# EAGLE design ForceBoard (EAGLE 9.4.2)
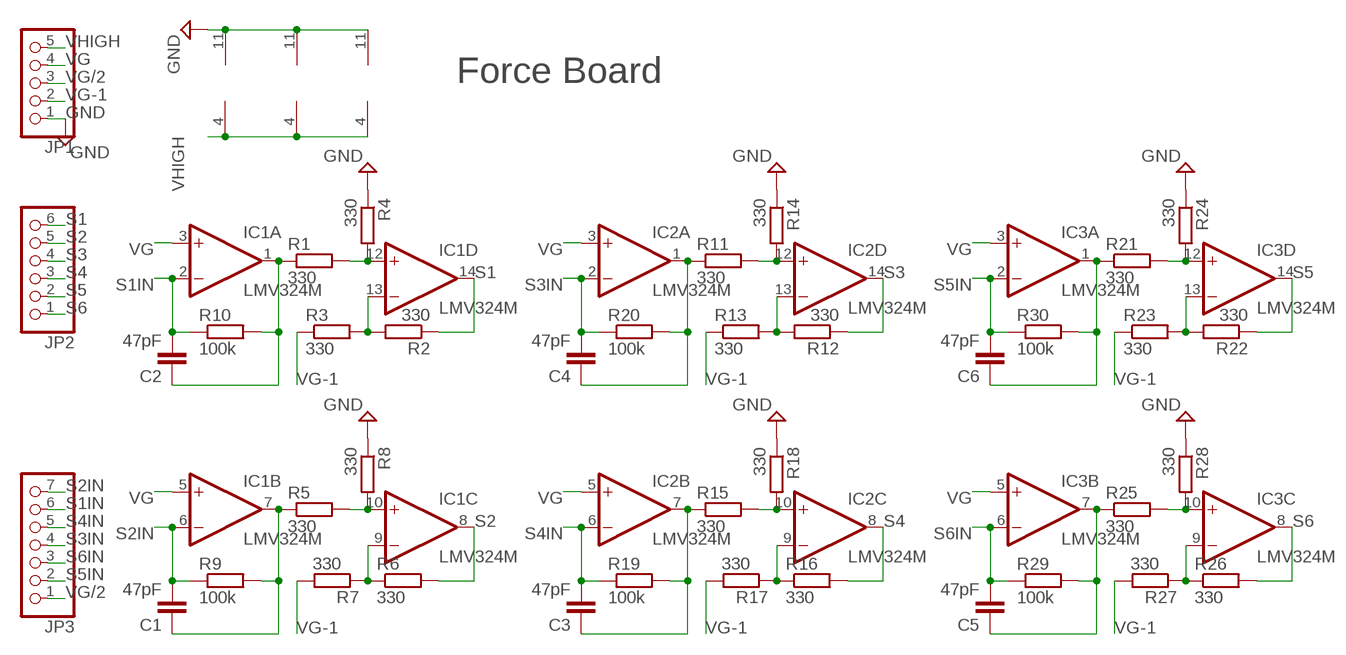
[diagram p0: schematic, sheet 1]

## Parts
C1  47pF  C-EUC0805  [C0805]
C2  47pF  C-EUC0805  [C0805]
C3  47pF  C-EUC0805  [C0805]
C4  47pF  C-EUC0805  [C0805]
C5  47pF  C-EUC0805  [C0805]
C6  47pF  C-EUC0805  [C0805]
IC1  LMV324M  [SO14]
IC2  LMV324M  [SO14]
IC3  LMV324M  [SO14]
JP1  PINHD-1X5  [1X05]
JP2  PINHD-1X6  [1X06]
JP3  PINHD-1X7  [1X07]
R1  330  R-EU_R0805  [R0805]
R2  330  R-EU_R0805  [R0805]
R3  330  R-EU_R0805  [R0805]
R4  330  R-EU_R0805  [R0805]
R5  330  R-EU_R0805  [R0805]
R6  330  R-EU_R0805  [R0805]
R7  330  R-EU_R0805  [R0805]
R8  330  R-EU_R0805  [R0805]
R9  100k  R-EU_R0805  [R0805]
R10  100k  R-EU_R0805  [R0805]
R11  330  R-EU_R0805  [R0805]
R12  330  R-EU_R0805  [R0805]
R13  330  R-EU_R0805  [R0805]
R14  330  R-EU_R0805  [R0805]
R15  330  R-EU_R0805  [R0805]
R16  330  R-EU_R0805  [R0805]
R17  330  R-EU_R0805  [R0805]
R18  330  R-EU_R0805  [R0805]
R19  100k  R-EU_R0805  [R0805]
R20  100k  R-EU_R0805  [R0805]
R21  330  R-EU_R0805  [R0805]
R22  330  R-EU_R0805  [R0805]
R23  330  R-EU_R0805  [R0805]
R24  330  R-EU_R0805  [R0805]
R25  330  R-EU_R0805  [R0805]
R26  330  R-EU_R0805  [R0805]
R27  330  R-EU_R0805  [R0805]
R28  330  R-EU_R0805  [R0805]
R29  100k  R-EU_R0805  [R0805]
R30  100k  R-EU_R0805  [R0805]

## Nets
GND: IC1.11(P:V-) IC2.11(P:V-) IC3.11(P:V-) JP1.1 R4.1 R8.1 R14.1 R18.1 R24.1 R28.1
N$1: IC2.13(D:-IN) R12.2 R13.2
N$2: IC1.10(C:+IN) R5.2 R8.2
N$3: IC1.13(D:-IN) R2.2 R3.2
N$4: C1.1 IC1.7(B:OUT) R5.1 R9.2
N$5: IC1.9(C:-IN) R6.1 R7.1
N$6: IC1.12(D:+IN) R1.2 R4.2
N$7: C3.1 IC2.7(B:OUT) R15.1 R19.2
N$8: IC2.9(C:-IN) R16.1 R17.1
N$9: C2.1 IC1.1(A:OUT) R1.1 R10.2
N$10: IC2.10(C:+IN) R15.2 R18.2
N$11: IC2.12(D:+IN) R11.2 R14.2
N$12: C4.1 IC2.1(A:OUT) R11.1 R20.2
N$13: IC3.13(D:-IN) R22.2 R23.2
N$14: C5.1 IC3.7(B:OUT) R25.1 R29.2
N$15: IC3.9(C:-IN) R26.1 R27.1
N$16: IC3.10(C:+IN) R25.2 R28.2
N$17: IC3.12(D:+IN) R21.2 R24.2
N$18: C6.1 IC3.1(A:OUT) R21.1 R30.2
S1: IC1.14(D:OUT) JP2.6 R2.1
S1IN: C2.2 IC1.2(A:-IN) JP3.6 R10.1
S2: IC1.8(C:OUT) JP2.5 R6.2
S2IN: C1.2 IC1.6(B:-IN) JP3.7 R9.1
S3: IC2.14(D:OUT) JP2.4 R12.1
S3IN: C4.2 IC2.2(A:-IN) JP3.4 R20.1
S4: IC2.8(C:OUT) JP2.3 R16.2
S4IN: C3.2 IC2.6(B:-IN) JP3.5 R19.1
S5: IC3.14(D:OUT) JP2.2 R22.1
S5IN: C6.2 IC3.2(A:-IN) JP3.2 R30.1
S6: IC3.8(C:OUT) JP2.1 R26.2
S6IN: C5.2 IC3.6(B:-IN) JP3.3 R29.1
VG: IC1.3(A:+IN) IC1.5(B:+IN) IC2.3(A:+IN) IC2.5(B:+IN) IC3.3(A:+IN) IC3.5(B:+IN) JP1.4
VG-1: JP1.2 R3.1 R7.2 R13.1 R17.2 R23.1 R27.2
VG/2: JP1.3 JP3.1
VHIGH: IC1.4(P:V+) IC2.4(P:V+) IC3.4(P:V+) JP1.5

## Notes on the sheet
- Force Board

## Library data of the parts
C1-C6 = rcl:C-EU: CAPACITOR, European symbol; SPICEPREFIX: C
IC1-IC3 = linear:LMV324?*: Quad General Purpose, Low Voltage, Rail-to-Rail Output Operational Amplifiers Source: http://www.national.com/mpf/LM/LMV321.html http://www.national.com/dt/lmv_qual.pdf
JP1 = pinhead2:PINHD-1X5: PIN HEADER
JP2 = pinhead2:PINHD-1X6: PIN HEADER
JP3 = pinhead2:PINHD-1X7: PIN HEADER
R1-R30 = rcl:R-EU_: RESISTOR, European symbol; SPICEPREFIX: R

## Board
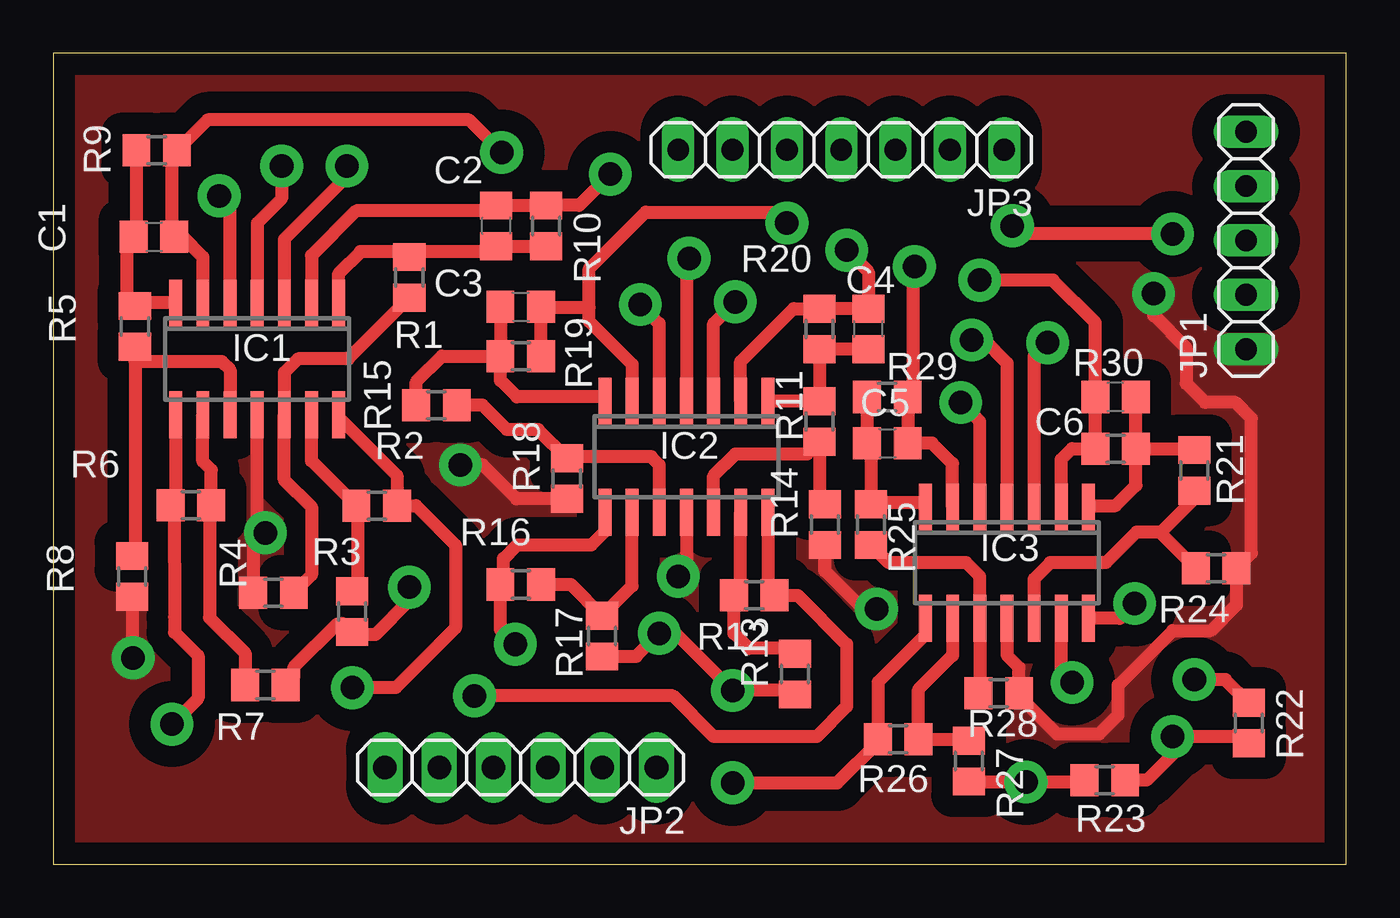
[diagram p1: board, top side]
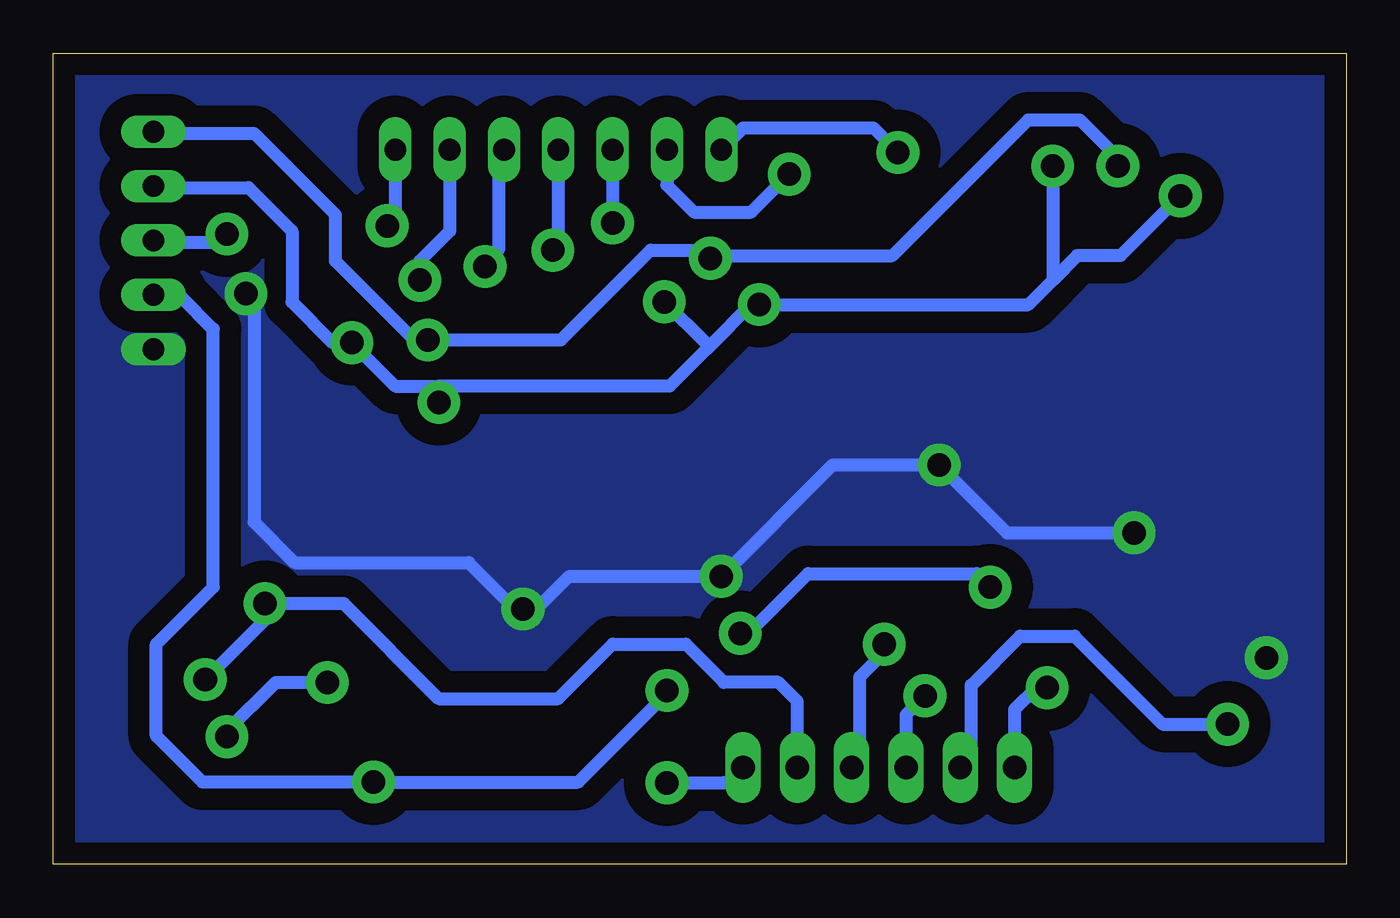
[diagram p2: board, bottom side, seen from below]

Size 60.43 x 37.9 mm. Coordinates in mm from the lower left corner, seen from the top.
Outline: 0,0 60.43,0 60.43,37.9 0,37.9 0,0
Copper layers (1*16): Top 0.035mm / dielectric 1.5mm / Bottom 0.035mm
Design rules "default *": minimum track width 6mil, minimum drill 0.35mm, track to track 0.8mm, track to pad 0.8mm, pad to pad 0.8mm, via to via 0.8mm, smd to smd 0.8mm, copper to edge 40mil, drill to drill 6mil, minimum pad ring 10mil, minimum via ring 8mil, stop-mask expansion 4mil, vias tented up to drill 0mil, thermal gap 10mil

### Footprints (pad centres in the part's own frame; a part is rotated, then mirrored left to right if it is on the bottom)
C0805 = smd 1.3 x 1.5: 1 -0.95,0; 2 0.95,0
SO14 = smd 0.6 x 2.2: 1 -3.81,-2.6; 2 -2.54,-2.6; 3 -1.27,-2.6; 4 0,-2.6; 5 1.27,-2.6; 6 2.54,-2.6; 7 3.81,-2.6; 8 3.81,2.6; 9 2.54,2.6; 10 1.27,2.6; 11 0,2.6; 12 -1.27,2.6; 13 -2.54,2.6; 14 -3.81,2.6
1X05 = drill 1.016 long: 1 -5.08,0; 2 -2.54,0; 3 0,0; 4 2.54,0; 5 5.08,0
1X06 = drill 1.1 long: 1 -6.35,0; 2 -3.81,0; 3 -1.27,0; 4 1.27,0; 5 3.81,0; 6 6.35,0
1X07 = drill 1.016 long: 1 -7.62,0; 2 -5.08,0; 3 -2.54,0; 4 0,0; 5 2.54,0; 6 5.08,0; 7 7.62,0
R0805 = smd 1.3 x 1.5: 1 -0.95,0; 2 0.95,0

### Placement (x,y rotation side)
C1  4.7,29.34 0 top
C2  20.7,29.84 90 top
C3  21.84,26.06 0 top
C4  38.1,25.02 90 top
C5  38.99,19.68 0 top
C6  49.66,21.84 180 top
IC1  9.53,23.62 180 top
IC2  29.59,19.05 180 top
IC3  44.58,14.1 180 top
JP1  55.75,29.16 90 top
JP2  21.84,4.52 180 top
JP3  36.83,33.4 180 top
R1  16.64,27.43 270 top
R2  15.11,16.76 180 top
R3  13.97,11.81 90 top
R4  10.29,12.7 0 top
R5  3.81,25.15 270 top
R6  6.43,16.79 180 top
R7  9.91,8.38 0 top
R8  3.68,13.46 90 top
R9  4.83,33.38 180 top
R10  23.04,29.84 270 top
R11  35.81,20.7 270 top
R12  32.77,12.57 180 top
R13  34.67,8.89 90 top
R14  36.07,15.88 90 top
R15  17.91,21.46 0 top
R16  21.84,13.08 180 top
R17  25.65,10.67 270 top
R18  24,18.03 90 top
R19  21.84,23.75 180 top
R20  35.81,25.02 270 top
R21  53.34,18.41 270 top
R22  55.88,6.6 270 top
R23  49.15,3.94 0 top
R24  54.36,13.84 180 top
R25  38.23,15.88 270 top
R26  39.5,5.84 180 top
R27  42.8,4.83 270 top
R28  44.2,8 180 top
R29  38.99,21.84 180 top
R30  49.66,19.43 0 top

### Tracks (layer width: path | path; a pad name or v marks a point on that pad's centre or on a via)
GND  (via drill 1.1 pad 2)
  Top 0.61: IC3.11 44.58,9.78 45.15,9.21 R28.1 45.15,7.87 46.92,6.1 48.89,6.1 49.78,6.99 49.78,8.38 52.32,10.92 54.1,10.92 55.31,12.13 R24.1 56.01,14.54 56.01,20.83 55.24,21.59 53.85,21.59 52.96,22.48 52.96,24.13 51.43,25.65 v51.43,26.67 | v38.48,11.94 37.85,11.94 36.07,13.72 R14.1 | IC2.11 29.59,13.84 v29.21,13.46 | IC1.11 9.53,15.88 v9.91,15.49 9.34,14.93 R4.1 | R8.1 3.68,9.69 v3.72,9.65 | R18.1 21.65,17.08 20.07,18.67 v19.02,18.67
  Bottom 0.61: v51.43,26.67 51.05,26.29 51.05,16 49.15,14.1 41.02,14.1 38.86,11.94 v38.48,11.94 37.85,11.94 36.32,13.46 v29.21,13.46 24,18.67 v19.02,18.67 15.85,15.49 v9.91,15.49
  pour Top (isolate 1, no thermals): 0,37.85 60.45,37.85 60.45,0 0,0
  pour Bottom (isolate 1, no thermals): 0,37.85 60.45,37.85 60.45,0 0,0
N$1
  Top 0.61: IC2.13 32.13,12.89 R12.2 31.82,10.8 32.52,10.09 34.42,10.09 R13.2
N$2
  Top 0.61: IC1.10 8.26,23.11 7.87,23.49 3.81,23.49 R5.2 3.81,14.54 R8.2
N$3
  Top 0.61: R3.2 14.22,13.02 14.22,16.7 R2.2 12.06,18.86 IC1.13
N$4
  Top 0.61: R9.2 3.88,29.46 C1.1 3.43,29.02 3.43,26.25 5.69,26.25 IC1.7 5.69,26.25 3.66,26.25 R5.1
N$5
  Top 0.61: IC1.9 6.99,18.83 7.38,18.44 R6.1 7.3,16.71 7.3,11.54 8.96,9.88 R7.1
N$6
  Top 0.61: R1.2 13.78,23.62 11.43,23.62 10.79,22.99 IC1.12 10.79,17.97 12.06,16.7 12.06,13.53 R4.2
N$7
  Top 0.61: IC2.7 25.59,21.84 21.67,21.84 20.89,22.62 R19.2 | C3.1 R19.2 | R15.1 16.96,22.54 18.16,23.75 R19.2
N$8
  Top 0.61: IC2.9 27.05,13.02 R17.1 24.19,13.08 R16.1
N$9
  Top 0.61: IC1.1 13.33,27.62 14.35,28.63 16.38,28.63 R1.1 16.89,28.64 19.3,28.64 20.45,28.64 C2.1 R10.2
N$10
  Top 0.61: IC2.10 28.32,18.67 27.94,19.05 24.07,19.05 R18.2 22.67,20.32 21.2,20.32 20.05,21.46 R15.2
N$11
  Top 0.61: R14.2 35.81,17.08 R11.2 35.24,19.18 31.88,19.18 30.86,18.16 IC2.12
N$12
  Top 0.61: C4.1 R20.2 R11.1 IC2.1
N$13  (via drill 1.1 pad 2)
  Top 0.61: R23.2 51.12,3.94 52.32,5.15 v52.32,5.97 55.57,5.97 R22.2 | v47.62,8.5 47.12,9 IC3.13
  Bottom 0.61: v52.32,5.97 52.32,6.21 50.04,8.5 v47.62,8.5
N$14
  Top 0.61: R29.2 C5.1 38.23,19.5 R25.1 38.29,16.89 40.57,16.89 IC3.7
N$15
  Top 0.61: IC3.9 42.04,9.77 40.45,8.18 R26.1 42.73,5.84 R27.1
N$16
  Top 0.61: R28.2 43.31,8.06 IC3.10 43.31,13.46 42.67,14.1 39.05,14.1 R25.2
N$17
  Top 0.61: R21.2 53.34,17.08 51.75,15.5 R24.2 51.72,15.53 50.64,15.53 49.21,14.1 46.61,14.1 45.85,13.34 IC3.12
N$18
  Top 0.61: IC3.1 48.45,16.76 49.66,16.76 50.61,17.71 R30.2 | R30.2 C6.1 | R30.2 53.27,19.43 R21.1
S1  (via drill 1.1 pad 2)
  Top 0.61: IC1.14 13.33,20.89 16.06,18.17 R2.1 16.95,16.76 18.8,14.92 18.8,11.05 16,8.25 v13.97,8.25
  Bottom 0.61: v13.97,8.25 14.48,8.25 15.49,7.24 JP2.6
S1IN  (via drill 1.1 pad 2)
  Top 0.61: v26.03,32.26 24.57,30.8 R10.1 C2.2 20.45,30.54 14.16,30.54 12.06,28.45 IC1.2
  Bottom 0.61: v26.03,32.26 27.81,30.48 30.48,30.48 31.75,31.75 JP3.6
S2  (via drill 1.1 pad 2)
  Top 0.61: IC1.8 5.71,21.01 5.71,17.02 R6.2 5.65,16.61 5.66,11.56 5.66,10.85 6.76,9.75 6.76,7.77 v5.54,6.55
  Bottom 0.61: v5.54,6.55 8.58,6.55 12.7,10.67 15.24,10.67 17.53,8.38 17.53,5.03 JP2.5
S2IN  (via drill 1.1 pad 2)
  Top 0.61: v20.95,33.27 19.43,34.8 7.2,34.8 R9.1 5.52,33.12 5.52,29.46 C1.2 6.03,29.34 6.99,28.38 IC1.6
  Bottom 0.61: v20.95,33.27 22.1,34.42 28.19,34.42 JP3.7
S3  (via drill 1.1 pad 2)
  Top 0.61: IC2.14 33.4,12.57 R12.1 34.8,12.57 37.08,10.29 37.08,7.37 35.69,5.97 30.86,5.97 28.96,7.87 v19.68,7.87
  Bottom 0.61: v19.68,7.87 20.57,6.99 JP2.4
S3IN  (via drill 1.1 pad 2)
  Top 0.61: v37.08,28.7 38.1,27.69 C4.2 R20.1 34.6,25.97 32.13,23.49 IC2.2
  Bottom 0.61: JP3.4 36.83,28.96 v37.08,28.7
S4  (via drill 1.1 pad 2)
  Top 0.61: 21.21,12.77 R16.2 | R16.2 21.04,13.23 21.04,14.29 21.69,14.94 25.15,14.94 25.78,15.57 IC2.8 | v21.59,10.29 20.89,10.98 R16.2
  Bottom 0.61: v21.59,10.29 21.59,9.91 22.73,8.76 22.73,5.46 23.11,5.08 JP2.3
S4IN  (via drill 1.1 pad 2)
  Top 0.61: IC2.6 27.05,23.37 25.04,25.38 25.04,26.04 | C3.2 22.82,26.04 | 22.82,26.04 22.79,26.04 R19.1 | 22.82,26.04 25.04,26.04 | 25.04,26.04 25.04,27.84 27.69,30.48 33.78,30.48 v34.29,29.97
  Bottom 0.61: JP3.5 v34.29,29.97
S5  (via drill 1.1 pad 2)
  Top 0.61: R22.1 54.8,8.64 v53.34,8.64 | v50.55,12.19 49.85,11.5 IC3.14
  Bottom 0.61: v53.34,8.64 50.55,11.43 v50.55,12.19 46.86,12.19 42.42,7.75 36.83,7.75 34.29,10.29 30.86,10.29 29.08,8.51 26.54,8.51 25.65,7.62 JP2.2
S5IN  (via drill 1.1 pad 2)
  Top 0.61: IC3.2 47.12,18.92 47.62,19.43 R30.1 C6.2 48.71,25.33 46.74,27.3 v43.31,27.3
  Bottom 0.61: v43.31,27.3 43.31,28.19 41.91,29.59 JP3.2
S6  (via drill 1.1 pad 2)
  Top 0.61: v31.75,3.81 36.64,3.81 38.55,5.71 R26.2 38.55,8.52 40.77,10.73 IC3.8
  Bottom 0.61: v31.75,3.81 29.11,3.81 29.08,3.83 28.88,3.83 JP2.1
S6IN  (via drill 1.1 pad 2)
  Top 0.61: IC3.6 42.04,18.73 41.08,19.68 C5.2 R29.1 40.19,22.1 40.19,27.87 v40.26,27.94
  Bottom 0.61: v40.26,27.94 40.26,28.07 39.62,28.7 39.62,33.15 JP3.3
VG  (via drill 1.1 pad 2)
  Top 0.61: v46.48,24.38 45.85,23.75 IC3.3 | v27.43,26.16 28.32,25.27 IC2.5 | v13.72,32.64 13.72,32.13 10.79,29.21 IC1.3 | v7.75,31.24 8.26,30.73 IC1.5 | IC3.5 43.31,20.7 v42.42,21.59 | IC2.3 30.86,25.27 v31.88,26.29
  Bottom 0.61: 29.91,24.07 31.62,22.35 42.42,22.35 | 29.91,24.07 27.62,26.35 v27.43,26.16 14.86,26.16 13.72,27.3 | 42.42,22.35 44.45,22.35 v46.48,24.38 47.37,24.38 49.28,26.29 49.28,29.59 51.31,31.62 55.68,31.62 JP1.4 | v13.72,32.64 13.72,27.3 | 13.72,27.3 12.57,28.45 10.54,28.45 v7.75,31.24 | v42.42,21.59 42.42,22.35 | v31.88,26.29 29.91,24.32 29.91,24.07
VG-1  (via drill 1.1 pad 2)
  Top 0.61: R23.1 48.11,3.85 v45.47,3.85 42.83,3.85 R27.2 | R7.2 11.24,8.76 11.24,9.2 13.27,11.24 13.59,11.24 R3.1 14.1,10.73 15.05,10.73 16.64,12.32 v16.64,12.95 | R13.1 34.48,8.13 v31.75,8.13 29.08,10.8 v28.32,10.8 27.24,9.72 R17.2
  Bottom 0.61: v31.75,8.13 31.75,8 35.9,3.85 v45.47,3.85 53.47,3.85 55.63,6.01 55.63,10.29 52.96,12.95 52.96,25.02 54.48,26.54 55.68,26.54 JP1.2 | v16.64,12.95 17.27,13.59 25.15,13.59 27.94,10.8 v28.32,10.8
VG/2  (via drill 1.1 pad 2)
  Top 0.61: v52.32,29.46 45.21,29.46 v44.83,29.84
  Bottom 0.61: v52.32,29.46 52.7,29.08 55.68,29.08 JP1.3 | v44.83,29.84 44.45,30.23 JP3.1
VHIGH  (via drill 1.1 pad 2)
  Top 0.61: v42.93,24.51 43.49,24.51 44.58,23.43 IC3.4 | v29.72,28.32 29.59,28.19 IC2.4 | v10.67,32.64 10.67,31.12 9.53,29.97 IC1.4
  Bottom 0.61: v10.67,32.64 10.67,33.02 12.45,34.8 14.86,34.8 21.21,28.45 29.59,28.45 v29.72,28.32 30.1,28.7 32.51,28.7 36.7,24.51 v42.93,24.51 43.56,24.51 47.24,28.19 47.24,30.35 51.05,34.16 55.68,34.16 JP1.5

### Text on the board
bValues: Force Board
tTest: Force Board